# EAGLE schematic sampahSIM (EAGLE 7.1.0)
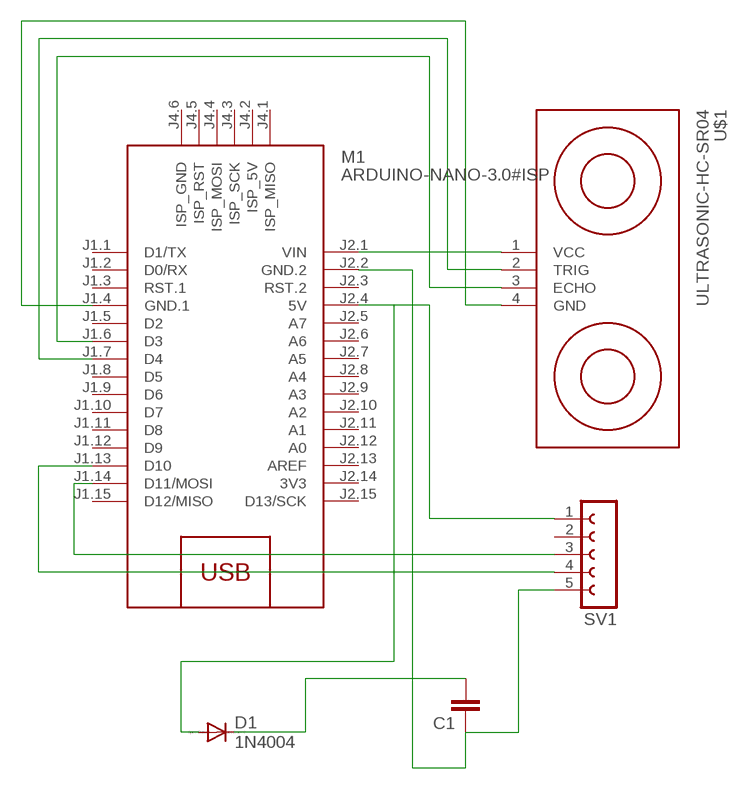
[diagram p0: schematic, sheet 1]

## Parts
C1  C2,5-3  [C2.5-3]
D1  1N4004  [DO41-10]
M1  ARDUINO-NANO-3.0#ISP  [ARDUINO-NANO-3.0#ISP]
SV1  FE05-1  [FE05-1]
U$1  ULTRASONIC-HC-SR04  [ULTRASONIC-HC-SR04]

## Nets
N$1: C1.2 D1.C
N$2: C1.1 M1.J2.2(GND.2) SV1.5
N$3: M1.J1.13(D10) SV1.4
N$5: M1.J1.14(D11/MOSI) SV1.3
N$6: D1.A M1.J2.4(5V) SV1.1
N$7: M1.J2.1(VIN) U$1.1(VCC)
N$8: M1.J1.7(D4) U$1.2(TRIG)
N$9: M1.J1.6(D3) U$1.3(ECHO)
N$10: M1.J1.4(GND.1) U$1.4(GND)
Unconnected: M1.J1.1(D1/TX) M1.J1.2(D0/RX) M1.J1.3(RST.1) M1.J1.5(D2) M1.J1.8(D5) M1.J1.9(D6) M1.J1.10(D7) M1.J1.11(D8) M1.J1.12(D9) M1.J1.15(D12/MISO) M1.J2.3(RST.2) M1.J2.5(A7) M1.J2.6(A6) M1.J2.7(A5) M1.J2.8(A4) M1.J2.9(A3) M1.J2.10(A2) M1.J2.11(A1) M1.J2.12(A0) M1.J2.13(AREF) M1.J2.15(D13/SCK) M1.J4.1(ISP_MISO) M1.J4.2(ISP_5V) M1.J4.3(ISP_SCK) M1.J4.4(ISP_MOSI) M1.J4.5(ISP_RST) M1.J4.6(ISP_GND) SV1.2

## Power pins joined to a net without a drawn wire
3V3: M1.J2.14(3V3)

## Library data of the parts
C1 = capacitor-wima:C: CAPACITOR naming: grid - package width
D1 = diode:1N4004: DIODE general purpose rectifier, 1 A
M1 = diy-modules (1):ARDUINO-NANO-3.0#ISP: Arduino Nano 3.0 (and compatible devices) with ISP pads More details available here: https://www.arduino.cc/en/Main/ArduinoBoardNano Click here to find device on ebay.com <http://www.ebay.com/sch/arduino+nano>
SV1 = con-lsta:FE05-1: FEMALE HEADER; OC_FARNELL: unknown; OC_NEWARK: unknown
U$1 = diy-modules (1):ULTRASONIC-HC-SR04: Ultrasonic Ranging Module HC-SR04 More details available here: http://randomnerdtutorials.com/complete-guide-for-ultrasonic-sensor-hc-sr04/ Click here to find device on ebay.com <http://www.ebay.com/sch/hc+sr04+ultrasonic>